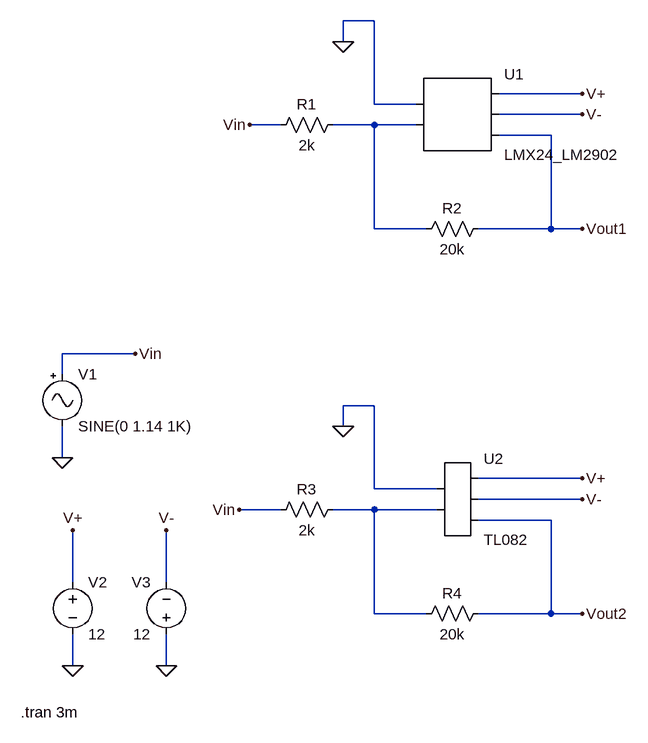
[diagram p0: schematic relat12.asc]
relat12.asc, the LTspice schematic file:
Version 4
SHEET 1 1332 1096
WIRE 96 16 48 16
WIRE 48 48 48 16
WIRE 416 128 288 128
WIRE 96 144 96 16
WIRE 160 144 96 144
WIRE 416 160 288 160
WIRE -48 176 -96 176
WIRE 96 176 32 176
WIRE 160 176 96 176
WIRE 368 192 288 192
WIRE 96 336 96 176
WIRE 176 336 96 336
WIRE 368 336 368 192
WIRE 368 336 256 336
WIRE 416 336 368 336
WIRE -272 528 -384 528
WIRE -384 560 -384 528
WIRE 96 608 48 608
WIRE 48 640 48 608
WIRE -384 688 -384 640
WIRE 416 720 256 720
WIRE 96 736 96 608
WIRE 192 736 96 736
WIRE 416 752 256 752
WIRE -48 768 -112 768
WIRE 96 768 32 768
WIRE 192 768 96 768
WIRE 368 784 256 784
WIRE -368 880 -368 800
WIRE -224 880 -224 800
WIRE 96 928 96 768
WIRE 176 928 96 928
WIRE 368 928 368 784
WIRE 368 928 256 928
WIRE 416 928 368 928
WIRE -368 1008 -368 960
WIRE -224 1008 -224 960
FLAG -384 688 0
FLAG 48 48 0
FLAG 416 336 Vout1
FLAG -368 1008 0
FLAG -224 1008 0
FLAG -368 800 V+
FLAG -224 800 V-
FLAG 416 128 V+
FLAG 416 160 V-
FLAG 48 640 0
FLAG 416 928 Vout2
FLAG 416 720 V+
FLAG 416 752 V-
FLAG -272 528 Vin
FLAG -96 176 Vin
FLAG -112 768 Vin
SYMBOL AutoGenerated\\LMX24_LM2902 224 160 R0
SYMATTR InstName U1
SYMBOL Misc\\signal -384 544 R0
WINDOW 123 0 0 Left 0
WINDOW 39 0 0 Left 0
SYMATTR InstName V1
SYMATTR Value SINE(0 1.14 1K)
SYMBOL res 48 160 R90
WINDOW 0 0 56 VBottom 2
WINDOW 3 32 56 VTop 2
SYMATTR InstName R1
SYMATTR Value 2k
SYMBOL res 272 320 R90
WINDOW 0 0 56 VBottom 2
WINDOW 3 32 56 VTop 2
SYMATTR InstName R2
SYMATTR Value 20k
SYMBOL voltage -368 864 R0
WINDOW 123 0 0 Left 0
WINDOW 39 0 0 Left 0
SYMATTR InstName V2
SYMATTR Value 12
SYMBOL voltage -224 976 R180
WINDOW 0 24 96 Left 2
WINDOW 3 24 16 Left 2
WINDOW 123 0 0 Left 0
WINDOW 39 0 0 Left 0
SYMATTR InstName V3
SYMATTR Value 12
SYMBOL res 48 752 R90
WINDOW 0 0 56 VBottom 2
WINDOW 3 32 56 VTop 2
SYMATTR InstName R3
SYMATTR Value 2k
SYMBOL res 272 912 R90
WINDOW 0 0 56 VBottom 2
WINDOW 3 32 56 VTop 2
SYMATTR InstName R4
SYMATTR Value 20k
SYMBOL AutoGenerated\\TL082 224 752 R0
SYMATTR InstName U2
TEXT -448 1080 Left 2 !.tran 3m

The netlist it stands for:
* relat12.asc
* U1: LMX24_LM2902 (symbol AutoGenerated\LMX24_LM2902 not available, pins judged from their places): pin1=0 pin2=N001 pin3=V+ pin4=V- pin5=Vout1
V1 Vin 0 SINE(0 1.14 1K)
R1 N001 Vin 2k
R2 Vout1 N001 20k
V2 V+ 0 12
V3 0 V- 12
R3 N002 Vin 2k
R4 Vout2 N002 20k
* U2: TL082 (symbol AutoGenerated\TL082 not available, pins judged from their places): pin1=0 pin2=N002 pin3=V+ pin4=V- pin5=Vout2
.tran 3m
.backanno
.end